# Altium schematic sheet Main.SchDoc
size A4; SheetNumber: 1; SheetTotal: 8
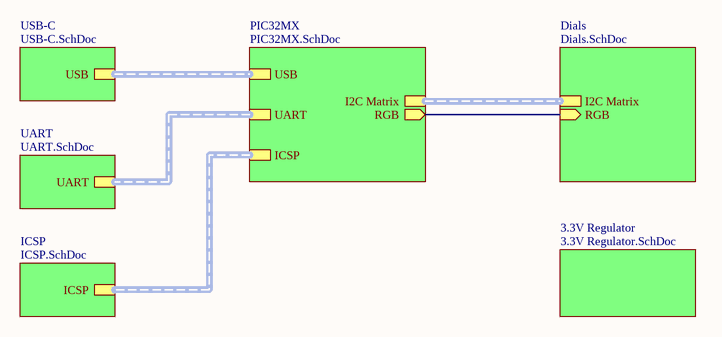
[diagram p0: Main.SchDoc]

## Sub-sheets
3.3V Regulator = 3.3V Regulator.SchDoc: no entries
Dials = Dials.SchDoc: I2C Matrix (harness I2C Matrix), RGB (in)
ICSP = ICSP.SchDoc: ICSP (harness ICSP)
PIC32MX = PIC32MX.SchDoc: I2C Matrix (harness I2C Matrix), RGB (out), USB (harness USB), ICSP (harness ICSP), UART (harness UART)
UART = UART.SchDoc: UART (harness UART)
USB-C = USB-C.SchDoc: USB (harness USB)

## Nets
(unnamed): sheet Dials/RGB, sheet PIC32MX/RGB

## Buses and harness runs
harness sheet Dials/I2C Matrix = sheet PIC32MX/I2C Matrix
harness sheet ICSP/ICSP = sheet PIC32MX/ICSP
harness sheet PIC32MX/UART = sheet UART/UART
harness sheet PIC32MX/USB = sheet USB-C/USB

## Notes on the sheet
- TITLE
- SIZE
- A4
- VARIANT
- PROJECT
- SHEET
- VERSION
- OF
- AUTHOR
- DATE